# Altium schematic sheet Audio_Jacks.SchDoc
size Letter
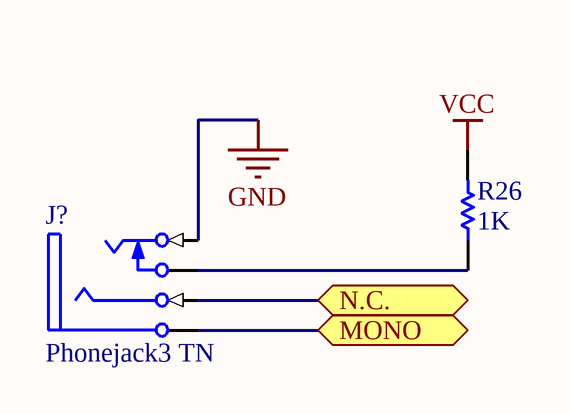
[diagram p0: Audio_Jacks.SchDoc]

## Parts
J?  Phonejack3 TN  [HDR1X4]
R26  value 1K  [AXIAL-0.3]  (hidden comment: Res1)

## Ports
MONO, N.C.

## Nets
GND: J?.1(T)
VCC: R26.2
MONO: J?.5(S) ; port MONO
N.C.: J?.3(R) ; port N.C.
NetJ?_2: J?.2(TN) R26.1

## Library data of the parts
J? = Phonejack3 TN: Jack Socket, 1/4" [6.5mm], Thru-Hole, Vertical, 3-Conductor with Tip closed & Ring open; PackageDocument: 2003; PCB_Layout: Complies with manufacturer's recommendation.; DrillAndSlotSize: Corresponds to nominal value.; Published: 15-Jul-2004; DatasheetDocument: 2003; PackageReference: S1VS_SSB; Publisher: Altium Limited; ComponentLink1Description: Manufacturer Link; ComponentLink1URL: http://www.cliffuk.co.uk/
R26 = Res1: Resistor; Published: 8-Jun-2000; LatestRevisionDate: 17-Jul-2002; LatestRevisionNote: Re-released for DXP Platform.; PackageReference: AXIAL-0.3; Publisher: Altium Limited; PackageDescription: Axial Device, Thru-Hole; 2 Leads; 0.3 in Pin Spacing